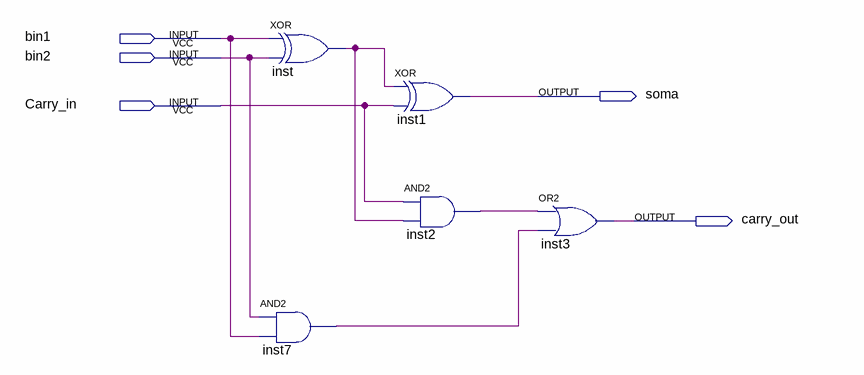
[diagram p0: schematic sheet]
// Quartus schematic adder.bdf as structural Verilog: 5 symbols, 5 pins
module adder (
  input  bin1,
  input  bin2,
  input  Carry_in,
  output soma,
  output carry_out
);

  wire inst2_out, inst7_out, inst_out;

  xor inst (inst_out, bin1, bin2);
  and inst7 (inst7_out, bin2, bin1);
  xor inst1 (soma, inst_out, Carry_in);
  and inst2 (inst2_out, Carry_in, inst_out);
  or inst3 (carry_out, inst2_out, inst7_out);
endmodule
